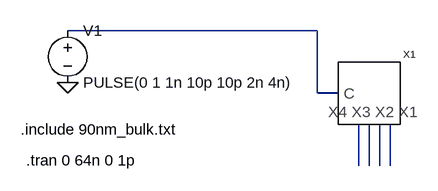
[diagram p0: schematic Draft3.asc]
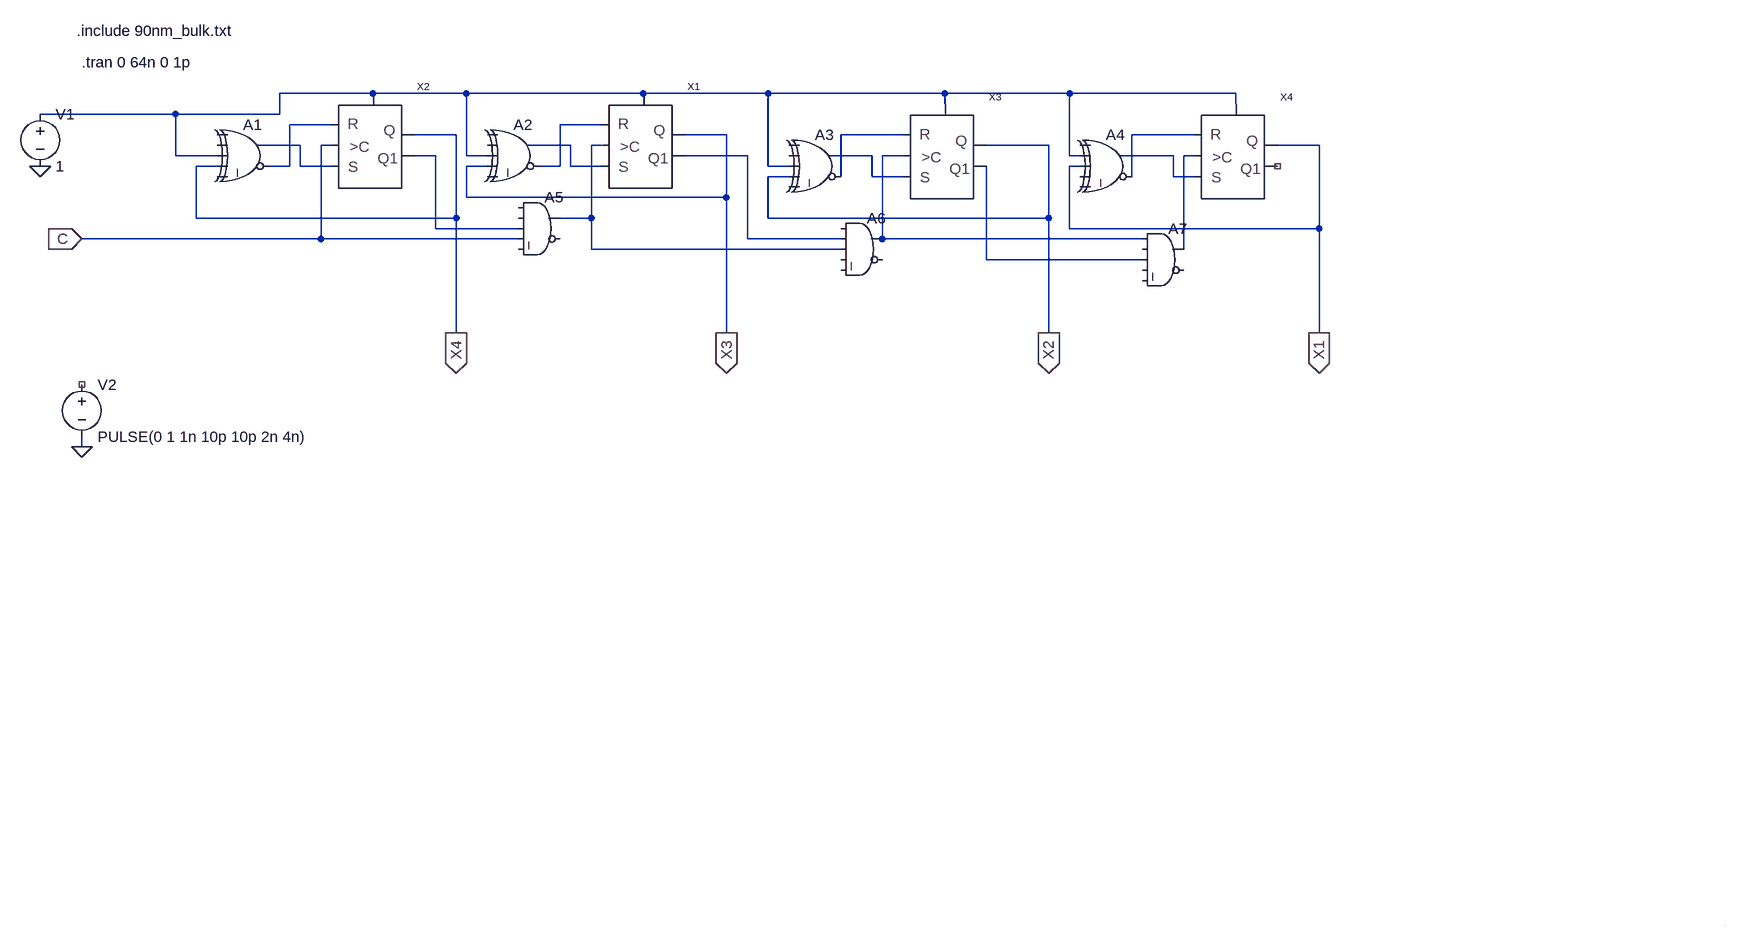
[diagram p1: sub-circuit counter.asc]
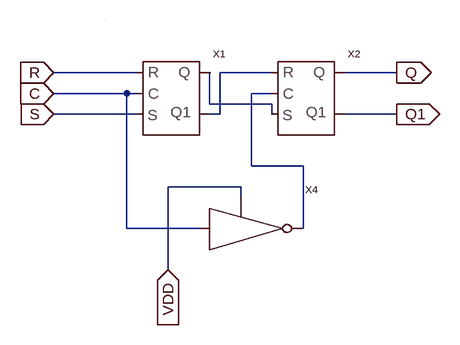
[diagram p2: sub-circuit rstriggerfront.asc]
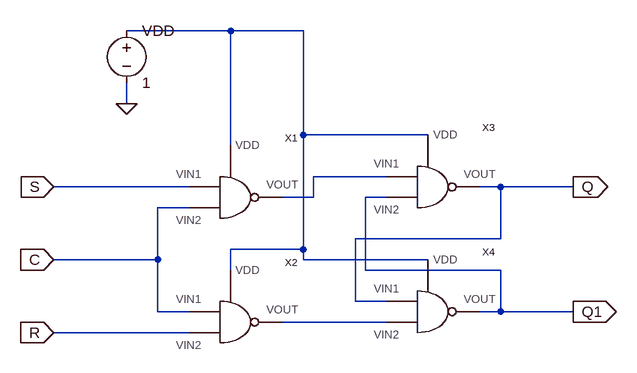
[diagram p3: sub-circuit rstrigger.asc]
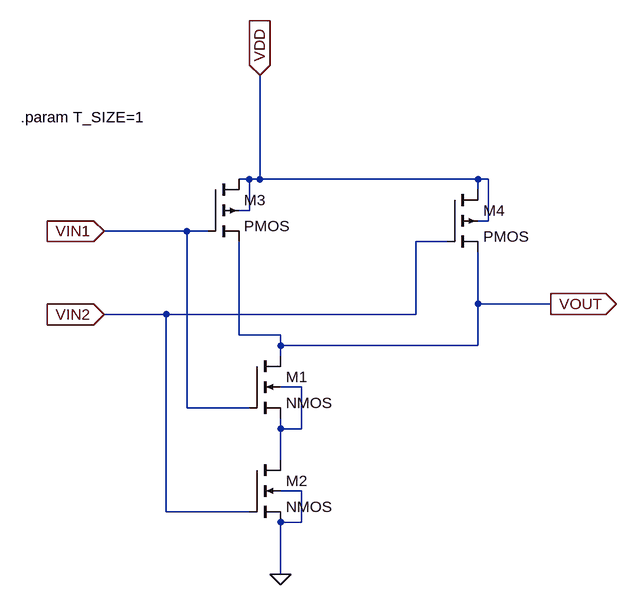
[diagram p4: sub-circuit andnot.asc]
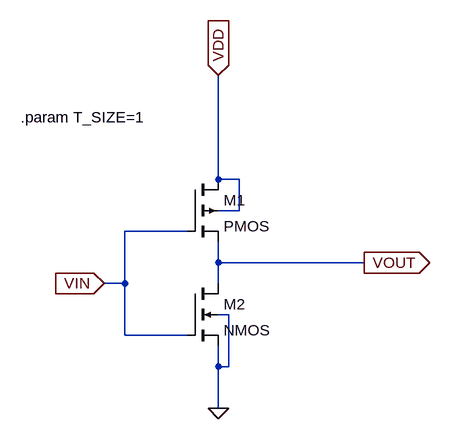
[diagram p5: sub-circuit not.asc]
Draft3.asc, the LTspice schematic file:
Version 4
SHEET 1 880 680
WIRE -848 -1072 -1232 -1072
WIRE -848 -976 -848 -1072
WIRE -816 -976 -848 -976
WIRE -784 -864 -784 -928
WIRE -768 -864 -768 -928
WIRE -752 -864 -752 -928
WIRE -736 -864 -736 -928
FLAG -1232 -992 0
SYMBOL Counter -768 -976 R0
SYMATTR InstName X1
SYMBOL voltage -1232 -1088 R0
WINDOW 123 0 0 Left 2
WINDOW 39 0 0 Left 2
SYMATTR InstName V1
SYMATTR Value PULSE(0 1 1n 10p 10p 2n 4n)
TEXT -1304 -920 Left 2 !.include 90nm_bulk.txt
TEXT -1296 -872 Left 2 !.tran 0 64n 0 1p

counter.asc, the sub-circuit schematic file:
Version 4
SHEET 1 880 680
WIRE -2080 -1280 -2224 -1280
WIRE -1936 -1280 -2080 -1280
WIRE -1664 -1280 -1936 -1280
WIRE -1472 -1280 -1664 -1280
WIRE -1200 -1280 -1472 -1280
WIRE -1008 -1280 -1200 -1280
WIRE -752 -1280 -1008 -1280
WIRE -1200 -1264 -1200 -1280
WIRE -752 -1264 -752 -1280
WIRE -2384 -1248 -2592 -1248
WIRE -2224 -1248 -2224 -1280
WIRE -2224 -1248 -2384 -1248
WIRE -2144 -1232 -2208 -1232
WIRE -1728 -1232 -1792 -1232
WIRE -1952 -1216 -2016 -1216
WIRE -1536 -1216 -1600 -1216
WIRE -1264 -1216 -1360 -1216
WIRE -816 -1216 -912 -1216
WIRE -2192 -1200 -2256 -1200
WIRE -2144 -1200 -2160 -1200
WIRE -1776 -1200 -1840 -1200
WIRE -1728 -1200 -1744 -1200
WIRE -1040 -1200 -1136 -1200
WIRE -624 -1200 -688 -1200
WIRE -2384 -1184 -2384 -1248
WIRE -2320 -1184 -2384 -1184
WIRE -1984 -1184 -2016 -1184
WIRE -1936 -1184 -1936 -1280
WIRE -1904 -1184 -1936 -1184
WIRE -1504 -1184 -1600 -1184
WIRE -1312 -1184 -1376 -1184
WIRE -1264 -1184 -1296 -1184
WIRE -1008 -1184 -1008 -1280
WIRE -992 -1184 -1008 -1184
WIRE -848 -1184 -928 -1184
WIRE -816 -1184 -832 -1184
WIRE -2320 -1168 -2352 -1168
WIRE -2208 -1168 -2208 -1232
WIRE -2208 -1168 -2240 -1168
WIRE -2192 -1168 -2192 -1200
WIRE -2144 -1168 -2192 -1168
WIRE -1904 -1168 -1936 -1168
WIRE -1792 -1168 -1792 -1232
WIRE -1792 -1168 -1824 -1168
WIRE -1776 -1168 -1776 -1200
WIRE -1728 -1168 -1776 -1168
WIRE -1472 -1168 -1472 -1280
WIRE -1440 -1168 -1472 -1168
WIRE -992 -1168 -1008 -1168
WIRE -1440 -1152 -1472 -1152
WIRE -1360 -1152 -1360 -1216
WIRE -1312 -1152 -1312 -1184
WIRE -1264 -1152 -1312 -1152
WIRE -912 -1152 -912 -1216
WIRE -848 -1152 -848 -1184
WIRE -816 -1152 -848 -1152
WIRE -1936 -1120 -1936 -1168
WIRE -1536 -1120 -1536 -1216
WIRE -1536 -1120 -1936 -1120
WIRE -2352 -1088 -2352 -1168
WIRE -1952 -1088 -1952 -1216
WIRE -1952 -1088 -2352 -1088
WIRE -1744 -1088 -1744 -1200
WIRE -1744 -1088 -1792 -1088
WIRE -1472 -1088 -1472 -1152
WIRE -1040 -1088 -1040 -1200
WIRE -1040 -1088 -1472 -1088
WIRE -1984 -1072 -1984 -1184
WIRE -1856 -1072 -1984 -1072
WIRE -1008 -1072 -1008 -1168
WIRE -624 -1072 -624 -1200
WIRE -624 -1072 -1008 -1072
WIRE -2160 -1056 -2160 -1200
WIRE -2160 -1056 -2528 -1056
WIRE -1856 -1056 -2160 -1056
WIRE -1504 -1056 -1504 -1184
WIRE -1360 -1056 -1504 -1056
WIRE -1296 -1056 -1296 -1184
WIRE -896 -1056 -1296 -1056
WIRE -1744 -1040 -1744 -1088
WIRE -1360 -1040 -1744 -1040
WIRE -832 -1040 -832 -1184
WIRE -1136 -1024 -1136 -1168
WIRE -896 -1024 -1136 -1024
WIRE -1952 -912 -1952 -1088
WIRE -1536 -912 -1536 -1120
WIRE -1040 -912 -1040 -1088
WIRE -624 -912 -624 -1072
WIRE -2528 -736 -2528 -752
WIRE 0 0 0 0
FLAG -2528 -736 0
FLAG -2592 -1168 0
FLAG -624 -912 X1
IOPIN -624 -912 Out
FLAG -1040 -912 X2
IOPIN -1040 -912 Out
FLAG -1536 -912 X3
IOPIN -1536 -912 Out
FLAG -1952 -912 X4
IOPIN -1952 -912 Out
FLAG -2528 -1056 C
IOPIN -2528 -1056 In
SYMBOL rstriggerfront -2080 -1200 R0
SYMATTR InstName X2
SYMBOL voltage -2528 -848 R0
WINDOW 123 0 0 Left 2
WINDOW 39 0 0 Left 2
SYMATTR InstName V2
SYMATTR Value PULSE(0 1 1n 10p 10p 2n 4n)
SYMBOL Digital\\xor -2272 -1248 R0
SYMATTR InstName A1
SYMBOL voltage -2592 -1264 R0
WINDOW 123 0 0 Left 2
WINDOW 39 0 0 Left 2
SYMATTR InstName V1
SYMATTR Value 1
SYMBOL rstriggerfront -1664 -1200 R0
SYMATTR InstName X1
SYMBOL Digital\\xor -1856 -1248 R0
SYMATTR InstName A2
SYMBOL rstriggerfront -1200 -1184 R0
SYMATTR InstName X3
SYMBOL Digital\\xor -1392 -1232 R0
SYMATTR InstName A3
SYMBOL rstriggerfront -752 -1184 R0
SYMATTR InstName X4
SYMBOL Digital\\xor -944 -1232 R0
SYMATTR InstName A4
SYMBOL Digital\\and -1824 -1136 R0
SYMATTR InstName A5
SYMBOL Digital\\and -1328 -1104 R0
SYMATTR InstName A6
SYMBOL Digital\\and -864 -1088 R0
SYMATTR InstName A7
TEXT -2536 -1376 Left 2 !.include 90nm_bulk.txt
TEXT -2528 -1328 Left 2 !.tran 0 64n 0 1p

rstriggerfront.asc, the sub-circuit schematic file:
Version 4
SHEET 1 880 680
WIRE 48 80 -80 80
WIRE 256 80 176 80
WIRE 448 80 368 80
WIRE 32 112 -80 112
WIRE 48 112 32 112
WIRE 256 112 224 112
WIRE 160 128 160 80
WIRE 256 128 160 128
WIRE 48 144 -80 144
WIRE 176 144 176 80
WIRE 176 144 160 144
WIRE 256 144 256 128
WIRE 448 144 368 144
WIRE 224 224 224 112
WIRE 304 224 224 224
WIRE 208 256 96 256
WIRE 208 272 208 256
WIRE 32 320 32 112
WIRE 144 320 32 320
WIRE 304 320 304 224
WIRE 96 384 96 256
WIRE 0 0 0 0
FLAG -80 80 R
IOPIN -80 80 In
FLAG -80 144 S
IOPIN -80 144 In
FLAG -80 112 C
IOPIN -80 112 In
FLAG 448 80 Q
IOPIN 448 80 Out
FLAG 448 144 Q1
IOPIN 448 144 Out
FLAG 96 384 VDD
IOPIN 96 384 In
SYMBOL rstrigger 112 128 R0
SYMATTR InstName X1
SYMBOL rstrigger 320 128 R0
SYMATTR InstName X2
SYMBOL not 208 320 R0
SYMATTR InstName X4

rstrigger.asc, the sub-circuit schematic file:
Version 4
SHEET 1 1220 680
WIRE 128 -96 -32 -96
WIRE 240 -96 128 -96
WIRE -32 16 -32 -16
WIRE 240 64 240 -96
WIRE 432 64 240 64
WIRE 128 80 128 -96
WIRE 368 128 256 128
WIRE 64 144 -144 144
WIRE 544 144 512 144
WIRE 656 144 544 144
WIRE 256 160 256 128
WIRE 256 160 208 160
WIRE 368 160 336 160
WIRE 64 176 16 176
WIRE 544 224 544 144
WIRE 544 224 320 224
WIRE 240 240 240 64
WIRE 240 240 128 240
WIRE 16 256 16 176
WIRE 16 256 -144 256
WIRE 240 256 240 240
WIRE 432 256 240 256
WIRE 128 272 128 240
WIRE 336 272 336 160
WIRE 544 272 336 272
WIRE 320 320 320 224
WIRE 368 320 320 320
WIRE 16 336 16 256
WIRE 64 336 16 336
WIRE 544 336 544 272
WIRE 544 336 512 336
WIRE 656 336 544 336
WIRE 368 352 208 352
WIRE 64 368 -144 368
FLAG -144 144 S
IOPIN -144 144 In
FLAG -144 368 R
IOPIN -144 368 In
FLAG -144 256 C
IOPIN -144 256 In
FLAG 656 144 Q
IOPIN 656 144 Out
FLAG 656 336 Q1
IOPIN 656 336 Out
FLAG -32 16 0
SYMBOL andnot 144 160 R0
SYMATTR InstName X1
SYMBOL andnot 144 352 R0
SYMATTR InstName X2
SYMBOL andnot 448 144 R0
SYMATTR InstName X3
SYMBOL andnot 448 336 R0
SYMATTR InstName X4
SYMBOL voltage -32 -112 R0
WINDOW 123 0 0 Left 2
WINDOW 39 0 0 Left 2
SYMATTR InstName VDD
SYMATTR Value 1

andnot.asc, the sub-circuit schematic file:
Version 4
SHEET 1 1176 868
WIRE 288 240 272 240
WIRE 304 240 304 80
WIRE 304 240 288 240
WIRE 640 240 304 240
WIRE 656 240 640 240
WIRE 640 256 640 240
WIRE 288 288 288 240
WIRE 288 288 272 288
WIRE 656 304 656 240
WIRE 656 304 640 304
WIRE 192 320 64 320
WIRE 224 320 192 320
WIRE 592 336 544 336
WIRE 640 432 640 352
WIRE 752 432 640 432
WIRE 160 448 64 448
WIRE 544 448 544 336
WIRE 544 448 160 448
WIRE 272 480 272 336
WIRE 336 480 272 480
WIRE 336 496 336 480
WIRE 640 496 640 432
WIRE 640 496 336 496
WIRE 336 512 336 496
WIRE 368 560 336 560
WIRE 192 592 192 320
WIRE 288 592 192 592
WIRE 336 624 336 608
WIRE 368 624 368 560
WIRE 368 624 336 624
WIRE 336 672 336 624
WIRE 368 720 336 720
WIRE 160 752 160 448
WIRE 288 752 160 752
WIRE 368 768 368 720
WIRE 368 768 336 768
WIRE 336 848 336 768
FLAG 64 320 VIN1
IOPIN 64 320 In
FLAG 64 448 VIN2
IOPIN 64 448 In
FLAG 304 80 VDD
IOPIN 304 80 In
FLAG 752 432 VOUT
IOPIN 752 432 Out
FLAG 336 848 0
SYMBOL nmos4 288 512 R0
SYMATTR InstName M1
SYMATTR Value2 l=90n w='{T_SIZE}*200n'
SYMBOL nmos4 288 672 R0
SYMATTR InstName M2
SYMATTR Value2 l=90n w='{T_SIZE}*200n'
SYMBOL pmos4 224 240 R0
SYMATTR InstName M3
SYMATTR Value2 l=90n w='{T_SIZE}*400n'
SYMBOL pmos4 592 256 R0
SYMATTR InstName M4
SYMATTR Value2 l=90n w='{T_SIZE}*400n'
TEXT -64 144 Left 2 !.param T_SIZE=1

not.asc, the sub-circuit schematic file:
Version 4
SHEET 1 1176 868
WIRE 240 240 240 80
WIRE 272 240 240 240
WIRE 272 288 272 240
WIRE 272 288 240 288
WIRE 192 320 96 320
WIRE 240 368 240 336
WIRE 464 368 240 368
WIRE 96 400 96 320
WIRE 96 400 64 400
WIRE 240 400 240 368
WIRE 256 448 240 448
WIRE 96 480 96 400
WIRE 192 480 96 480
WIRE 240 528 240 496
WIRE 256 528 256 448
WIRE 256 528 240 528
WIRE 240 592 240 528
FLAG 64 400 VIN
IOPIN 64 400 In
FLAG 240 80 VDD
IOPIN 240 80 In
FLAG 464 368 VOUT
IOPIN 464 368 Out
FLAG 240 592 0
SYMBOL nmos4 192 400 R0
SYMATTR InstName M2
SYMATTR Value2 l=90n w='{T_SIZE}*200n'
SYMBOL pmos4 192 240 R0
SYMATTR InstName M1
SYMATTR Value2 l=90n w='{T_SIZE}*400n'
TEXT -64 144 Left 2 !.param T_SIZE=1

The netlist it stands for:
* Draft3.asc
XX1 N001 N005 N004 N003 N002 counter
V1 N001 0 PULSE(0 1 1n 10p 10p 2n 4n)

* block symbol definitions
.subckt counter C X4 X3 X2 X1
XX2 N002 C N006 X4 N009 N001 rstriggerfront
V2 NC_01 0 PULSE(0 1 1n 10p 10p 2n 4n)
A1 0 0 N001 X4 0 N002 N006 0 XOR
V1 N001 0 1
XX1 N003 N008 N007 X3 N010 N001 rstriggerfront
A2 0 0 N001 X3 0 N003 N007 0 XOR
XX3 N004 N012 N011 X2 N015 N001 rstriggerfront
A3 0 0 N001 X2 0 N004 N011 0 XOR
XX4 N005 N014 N013 X1 NC_02 N001 rstriggerfront
A4 0 N001 X1 0 0 N005 N013 0 XOR
A5 0 0 N009 C 0 0 N008 0 AND
A6 0 N010 N008 0 0 0 N012 0 AND
A7 N012 0 N015 0 0 0 N014 0 AND
.include 90nm_bulk.txt
.tran 0 64n 0 1p
.ends counter

.subckt rstriggerfront R C S Q Q1 VDD
XX1 R S C N003 N001 rstrigger
XX2 N001 N003 N002 Q Q1 rstrigger
XX4 C N002 VDD not
.ends rstriggerfront

.subckt rstrigger R S C Q Q1
XX1 S C N002 N001 andnot
XX2 C R N003 N001 andnot
XX3 N002 Q1 Q N001 andnot
XX4 Q N003 Q1 N001 andnot
VDD N001 0 1
.ends rstrigger

.subckt andnot VIN1 VIN2 VOUT VDD
M1 VOUT VIN1 N001 N001 NMOS l=90n w='{T_SIZE}*200n'
M2 N001 VIN2 0 0 NMOS l=90n w='{T_SIZE}*200n'
M3 VDD VIN1 VOUT VDD PMOS l=90n w='{T_SIZE}*400n'
M4 VDD VIN2 VOUT VDD PMOS l=90n w='{T_SIZE}*400n'
.param T_SIZE=1
.ends andnot

.subckt not VIN VOUT VDD
M2 VOUT VIN 0 0 NMOS l=90n w='{T_SIZE}*200n'
M1 VDD VIN VOUT VDD PMOS l=90n w='{T_SIZE}*400n'
.param T_SIZE=1
.ends not

.model NMOS NMOS
.model PMOS PMOS
.lib standard.mos
.include 90nm_bulk.txt
.tran 0 64n 0 1p
.backanno
.end